# Altium schematic sheet GPIO.SchDoc
size A3; SheetNumber: 9; SheetTotal: 15
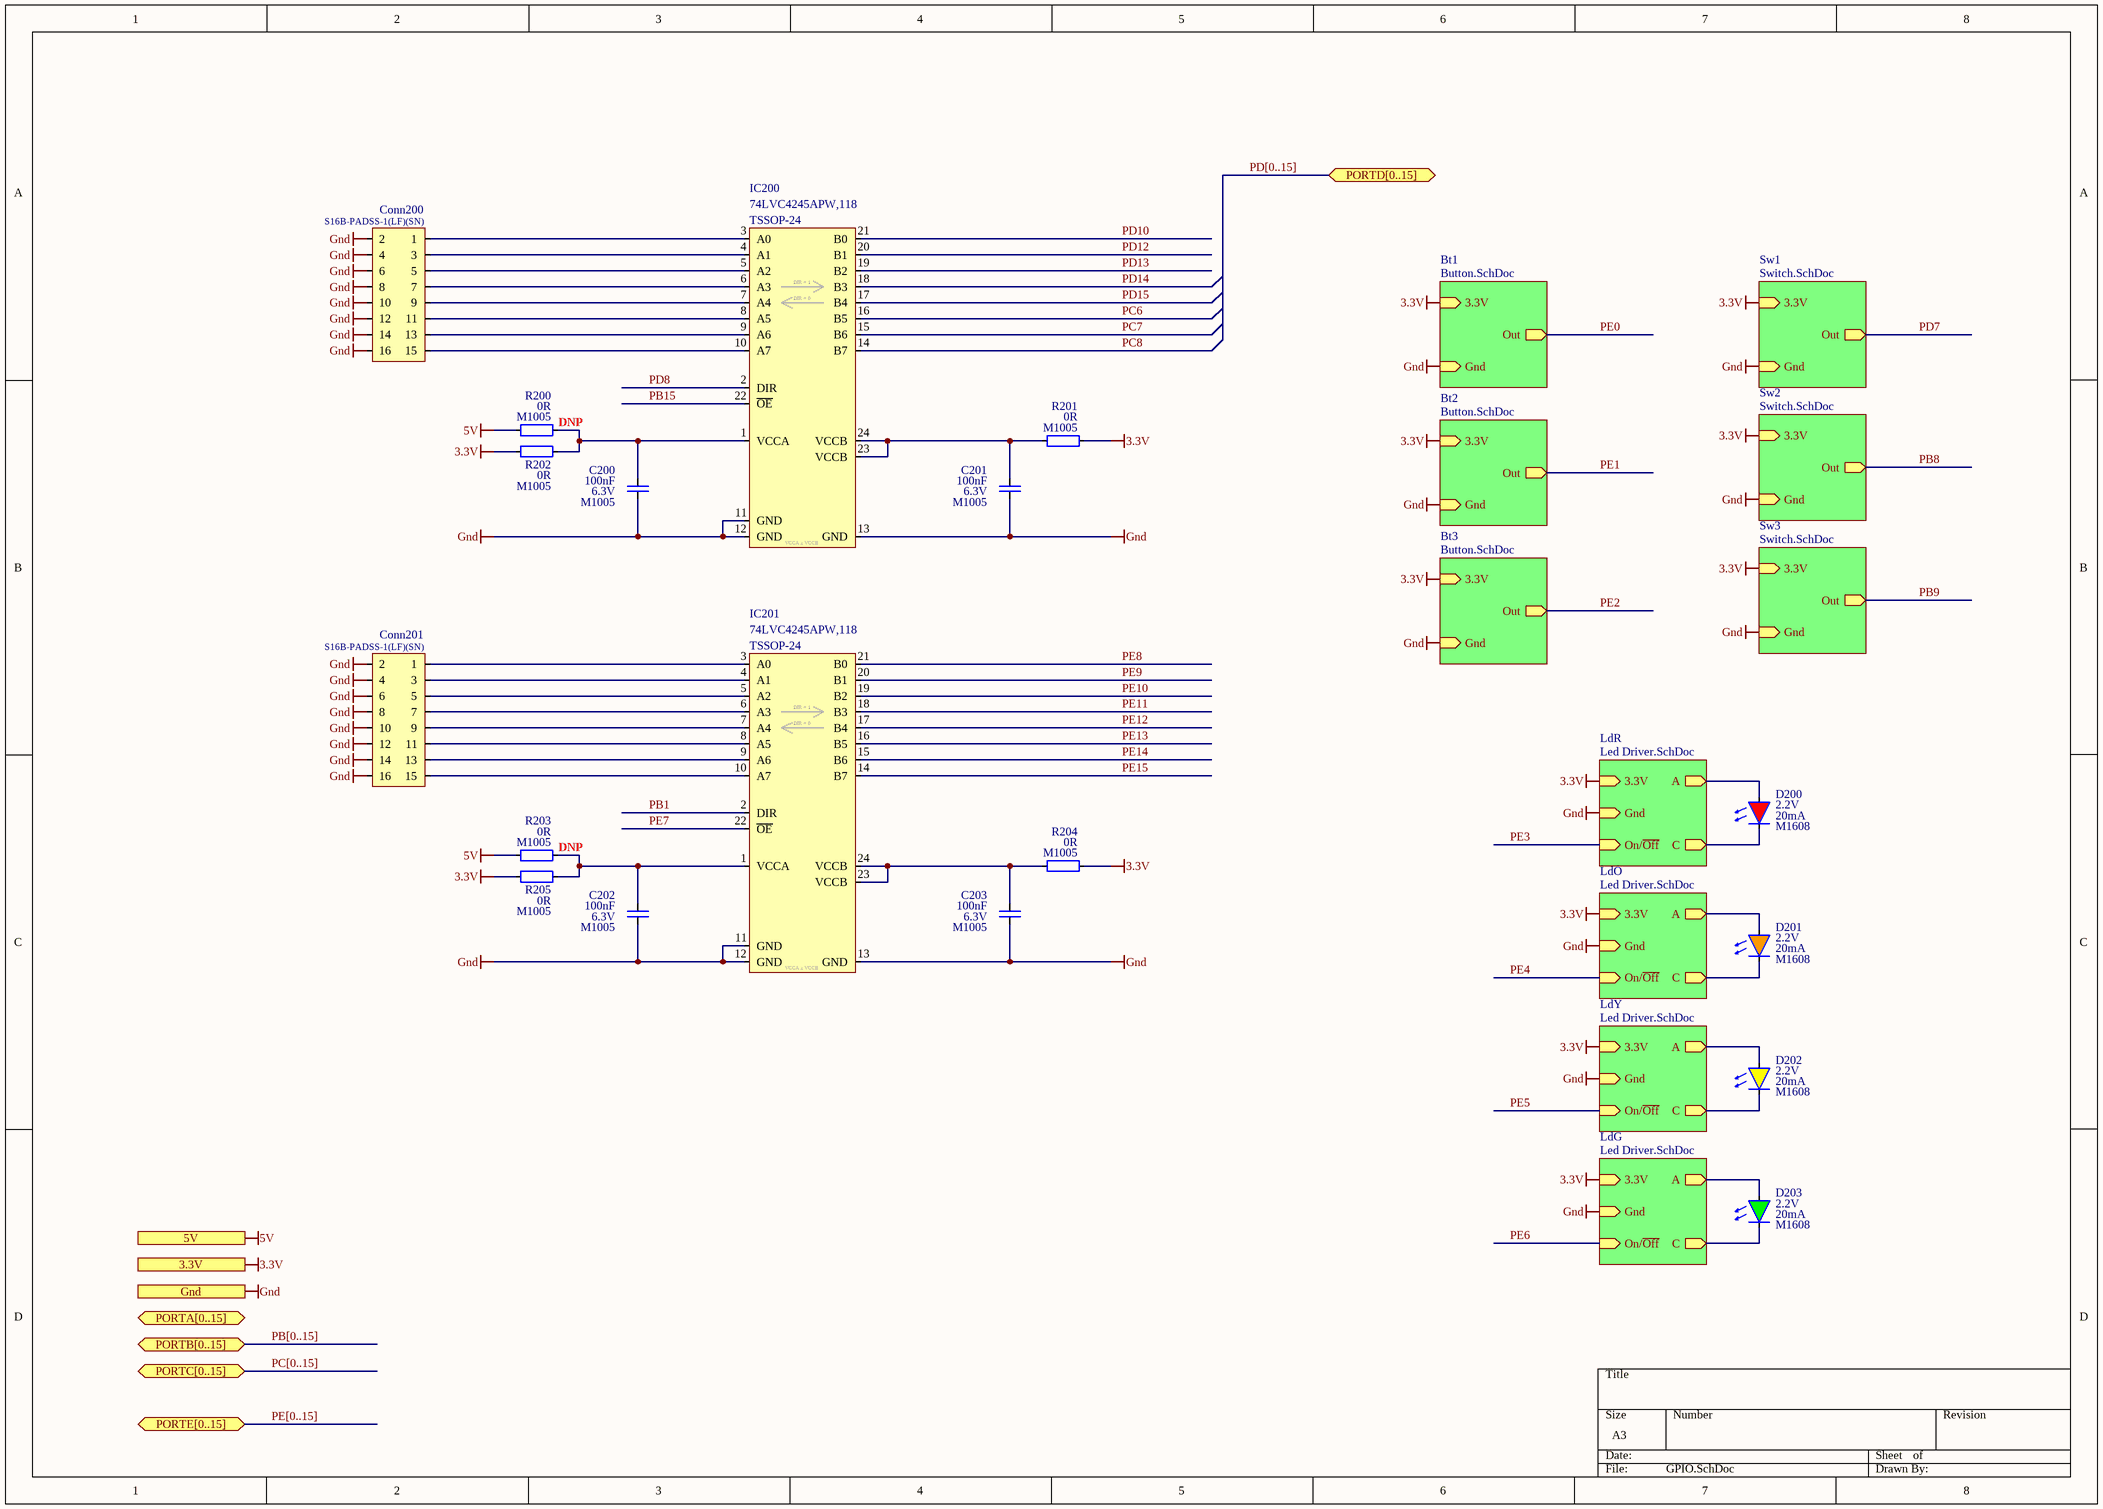
[diagram p0: GPIO.SchDoc]

## Parts
C200  value 100nF  Voltage: 6.3V  Package: M1005  [Capacitor_Ceramic_M1005_I0402]  (hidden comment: Capacitor_Ceramic)
C201  value 100nF  Voltage: 6.3V  Package: M1005  [Capacitor_Ceramic_M1005_I0402]  (hidden comment: Capacitor_Ceramic)
C202  value 100nF  Voltage: 6.3V  Package: M1005  [Capacitor_Ceramic_M1005_I0402]  (hidden comment: Capacitor_Ceramic)
C203  value 100nF  Voltage: 6.3V  Package: M1005  [Capacitor_Ceramic_M1005_I0402]  (hidden comment: Capacitor_Ceramic)
Conn200  Manufacturer Part Number: S16B-PADSS-1(LF)(SN)  [Connector, S16B-PADSS-1]  (hidden comment: Connector - 16P)
Conn201  Manufacturer Part Number: S16B-PADSS-1(LF)(SN)  [Connector, S16B-PADSS-1]  (hidden comment: Connector - 16P)
D200  Current: 20mA  Voltage: 2.2V  Package: M1608  [Diode_Smd_M1608_I0603_Red]  (hidden comment: Diode_Led)
D201  Current: 20mA  Voltage: 2.2V  Package: M1608  [Diode_Smd_M1608_I0603_Orange1]  (hidden comment: Diode_Led)
D202  Current: 20mA  Voltage: 2.2V  Package: M1608  [Diode_Smd_M1608_I0603_Yellow]  (hidden comment: Diode_Led)
D203  Current: 20mA  Voltage: 2.2V  Package: M1608  [Diode_Smd_M1608_I0603_Green-Yellow]  (hidden comment: Diode_Led)
IC200  Manufacturer Part Number: 74LVC4245APW,118  [TSSOP-24]  (hidden comment: Nexperia, 74LVC4245A)
IC201  Manufacturer Part Number: 74LVC4245APW,118  [TSSOP-24]  (hidden comment: Nexperia, 74LVC4245A)
R200  value 0R  Package: M1005  [Resistor_Smd_M1005_I0402]  (hidden comment: Resistor)
R201  value 0R  Package: M1005  [Resistor_Smd_M1005_I0402]  (hidden comment: Resistor)
R202  value 0R  Package: M1005  [Resistor_Smd_M1005_I0402]  (hidden comment: Resistor)
R203  value 0R  Package: M1005  [Resistor_Smd_M1005_I0402]  (hidden comment: Resistor)
R204  value 0R  Package: M1005  [Resistor_Smd_M1005_I0402]  (hidden comment: Resistor)
R205  value 0R  Package: M1005  [Resistor_Smd_M1005_I0402]  (hidden comment: Resistor)

## Sub-sheets
Bt1 = Button.SchDoc: 3.3V (in), Gnd (in), Out (out)
Bt2 = Button.SchDoc: 3.3V (in), Gnd (in), Out (out)
Bt3 = Button.SchDoc: 3.3V (in), Gnd (in), Out (out)
LdG = Led Driver.SchDoc: 3.3V (in), Gnd (in), A (out), C (out), On/~{Off} (in)
LdO = Led Driver.SchDoc: 3.3V (in), Gnd (in), A (out), C (out), On/~{Off} (in)
LdR = Led Driver.SchDoc: 3.3V (in), Gnd (in), A (out), C (out), On/~{Off} (in)
LdY = Led Driver.SchDoc: 3.3V (in), Gnd (in), A (out), C (out), On/~{Off} (in)
Sw1 = Switch.SchDoc: 3.3V (in), Gnd (in), Out (out)
Sw2 = Switch.SchDoc: 3.3V (in), Gnd (in), Out (out)
Sw3 = Switch.SchDoc: 3.3V (in), Gnd (in), Out (out)

## Ports
3.3V (in), 5V (in), Gnd (in), PORTA[0..15] (bidir), PORTB[0..15] (bidir), PORTC[0..15] (bidir), PORTD[0..15] (bidir), PORTE[0..15] (bidir)

## Nets
3.3V: R201.1 R202.2 R204.1 R205.2 ; port 3.3V, sheet Bt1/3.3V, sheet Bt2/3.3V, sheet Bt3/3.3V, sheet Sw1/3.3V, sheet Sw2/3.3V, sheet Sw3/3.3V, sheet LdR/3.3V, sheet LdO/3.3V, sheet LdY/3.3V, sheet LdG/3.3V
5V: R200.2 R203.2 ; port 5V
Gnd: C200.2 C201.2 C202.2 C203.2 Conn200.2 Conn200.4 Conn200.6 Conn200.8 Conn200.10 Conn200.12 Conn200.14 Conn200.16 Conn201.2 Conn201.4 Conn201.6 Conn201.8 Conn201.10 Conn201.12 Conn201.14 Conn201.16 IC200.11(GND) IC200.12(GND) IC200.13(GND) IC201.11(GND) IC201.12(GND) IC201.13(GND) ; port Gnd, sheet Bt1/Gnd, sheet Bt2/Gnd, sheet Bt3/Gnd, sheet Sw1/Gnd, sheet Sw2/Gnd, sheet Sw3/Gnd, sheet LdR/Gnd, sheet LdO/Gnd, sheet LdY/Gnd, sheet LdG/Gnd
PB1: IC201.2(DIR)
PB8: sheet Sw2/Out
PB9: sheet Sw3/Out
PB15: IC200.22(~{OE})
PC6: IC200.16(B5)
PC7: IC200.15(B6)
PC8: IC200.14(B7)
PD7: sheet Sw1/Out
PD8: IC200.2(DIR)
PD10: IC200.21(B0)
PD12: IC200.20(B1)
PD13: IC200.19(B2)
PD14: IC200.18(B3)
PD15: IC200.17(B4)
PE0: sheet Bt1/Out
PE1: sheet Bt2/Out
PE2: sheet Bt3/Out
PE3: sheet LdR/On/~{Off}
PE4: sheet LdO/On/~{Off}
PE5: sheet LdY/On/~{Off}
PE6: sheet LdG/On/~{Off}
PE7: IC201.22(~{OE})
PE8: IC201.21(B0)
PE9: IC201.20(B1)
PE10: IC201.19(B2)
PE11: IC201.18(B3)
PE12: IC201.17(B4)
PE13: IC201.16(B5)
PE14: IC201.15(B6)
PE15: IC201.14(B7)
NetC200_1: C200.1 IC200.1(VCCA) R200.1 R202.1
NetC201_1: C201.1 IC200.23(VCCB) IC200.24(VCCB) R201.2
NetC202_1: C202.1 IC201.1(VCCA) R203.1 R205.1
NetC203_1: C203.1 IC201.23(VCCB) IC201.24(VCCB) R204.2
NetConn200_1: Conn200.1 IC200.3(A0)
NetConn200_3: Conn200.3 IC200.4(A1)
NetConn200_5: Conn200.5 IC200.5(A2)
NetConn200_7: Conn200.7 IC200.6(A3)
NetConn200_9: Conn200.9 IC200.7(A4)
NetConn200_11: Conn200.11 IC200.8(A5)
NetConn200_13: Conn200.13 IC200.9(A6)
NetConn200_15: Conn200.15 IC200.10(A7)
NetConn201_1: Conn201.1 IC201.3(A0)
NetConn201_3: Conn201.3 IC201.4(A1)
NetConn201_5: Conn201.5 IC201.5(A2)
NetConn201_7: Conn201.7 IC201.6(A3)
NetConn201_9: Conn201.9 IC201.7(A4)
NetConn201_11: Conn201.11 IC201.8(A5)
NetConn201_13: Conn201.13 IC201.9(A6)
NetConn201_15: Conn201.15 IC201.10(A7)
NetD200_A: D200.A ; sheet LdR/A
NetD200_C: D200.C ; sheet LdR/C
NetD201_A: D201.A ; sheet LdO/A
NetD201_C: D201.C ; sheet LdO/C
NetD202_A: D202.A ; sheet LdY/A
NetD202_C: D202.C ; sheet LdY/C
NetD203_A: D203.A ; sheet LdG/A
NetD203_C: D203.C ; sheet LdG/C

## Buses and harness runs
bus PB[0..15] = port PORTB[0..15]
bus PC[0..15] = port PORTC[0..15]
bus PD[0..15] = port PORTD[0..15]
bus PE[0..15] = port PORTE[0..15]

## Notes on the sheet
- (near R200) DNP
- (near R203) DNP
- (in symbol Nexperia, 74LVC4245A) DIR = 1; DIR = 0; VCCA ≥ VCCB

## Library data of the parts
C200-C203 = Capacitor_Ceramic: Cap, Cer, 100nF, 6.3V, M1005; Manufacturer Part Number: 04026D104KAT4A; Manufacturer: Kyocera; Temperature Coefficient: X5R; Tolerance: 10%; ComponentLink1Description: Datasheet; ComponentLink1URL: E:\Altium\Datasheets\Capacitor\Kyocera - X5R.pdf; ComponentLink2Description: Supplier Link; ComponentLink2URL: https://www.digikey.com/en/products/detail/kyocera-avx/04026D104KAT4A/8107673; Supplier: Digikey; Supplier Part Number: 478-11504-1-ND; Operating Temperature, Min: +85℃; Operating Temperature, Max: -55℃; Quantity, Min: 1; Quantity, Max: 250000; Price, Min: 0.1; Supplier Currency: $; Price, Max: 0.00189; Supplier Link: https://www.digikey.com/en/products/detail/kyocera-avx/04026D104KAT4A/8107673; Component Type: Ceramic; Component Category: Capacitor
Conn200 Conn201 = Connector - 16P: Conn, JST, 16P, TH, PAD, Side Entry; ComponentLink1Description: Datasheet; ComponentLink1URL: E:\Altium\Datasheets\Connector - JST\PAD Family.pdf; ComponentLink2Description: Supplier Link; ComponentLink2URL: https://www.digikey.com/en/products/detail/jst-sales-america-inc/S16B-PADSS-1-LF-SN/1634778; Supplier: Digikey; Supplier Part Number: 455-2037-ND; Manufacturer: JST; Operating Temperature, Min: -25℃; Operating Temperature, Max: +85℃; Quantity, Min: 1; Quantity, Max: 10080; Price, Min: 0.77; Supplier Currency: $; Price, Max: 0.35386; Supplier Link: https://www.digikey.com/en/products/detail/jst-sales-america-inc/S16B-PADSS-1-LF-SN/1634778; Component Type: PCB; Component Category: Connector; Package: TH, 2 Rows, RA, Side Entry
D200 = Diode_Led: Diode, Led, Red, 2.2V, 20mA, M1608; Manufacturer Part Number: SML-D12U1WT86; Manufacturer: Rohm; ComponentLink1Description: Datasheet; ComponentLink1URL: E:\Altium\Datasheets\Diode\Rohm, SML-D12x1 Series.pdf; ComponentLink2Description: Supplier Link; ComponentLink2URL: https://www.digikey.com/en/products/detail/rohm-semiconductor/SML-D12U1WT86/5843853; Supplier: Digikey; Supplier Part Number: SML-D12U1WT86CT-ND; Operating Temperature, Min: -40℃; Operating Temperature, Max: +85℃; Quantity, Min: 1; Quantity, Max: 75000; Price, Min: 0.25; Price, Max: 0.02838; Supplier Currency: $; Supplier Link: https://www.digikey.com/en/products/detail/rohm-semiconductor/SML-D12U1WT86/5843853; Component Type: Led; Component Category: Diode
D201 = Diode_Led: Diode, Led, Orange, 2.2V, 20mA, M1608; Manufacturer Part Number: SML-D12D1WT86; Manufacturer: Rohm; ComponentLink1Description: Datasheet; ComponentLink1URL: E:\Altium\Datasheets\Diode\Rohm, SML-D12x1 Series.pdf; ComponentLink2Description: Supplier Link; ComponentLink2URL: https://www.digikey.com/en/products/detail/rohm-semiconductor/SML-D12D1WT86/5843854; Supplier: Digikey; Supplier Part Number: SML-D12D1WT86CT-ND; Operating Temperature, Min: -40℃; Operating Temperature, Max: +85℃; Quantity, Min: 1; Quantity, Max: 75000; Price, Min: 0.25; Price, Max: 0.02838; Supplier Currency: $; Supplier Link: https://www.digikey.com/en/products/detail/rohm-semiconductor/SML-D12D1WT86/5843854; Component Type: Led; Component Category: Diode
D202 = Diode_Led: Diode, Led, Yellow, 2.2V, 20mA, M1608; Manufacturer Part Number: SML-D12Y1WT86; Manufacturer: Rohm; ComponentLink1Description: Datasheet; ComponentLink1URL: E:\Altium\Datasheets\Diode\Rohm, SML-D12x1 Series.pdf; ComponentLink2Description: Supplier Link; ComponentLink2URL: https://www.digikey.com/en/products/detail/rohm-semiconductor/SML-D12Y1WT86/5843855; Supplier: Digikey; Supplier Part Number: SML-D12Y1WT86CT-ND; Operating Temperature, Min: -40℃; Operating Temperature, Max: +85℃; Quantity, Min: 1; Quantity, Max: 75000; Price, Min: 0.25; Price, Max: 0.02838; Supplier Currency: $; Supplier Link: https://www.digikey.com/en/products/detail/rohm-semiconductor/SML-D12Y1WT86/5843855; Component Type: Led; Component Category: Diode
D203 = Diode_Led: Diode, Led, Green-Yellow, 2.2V, 20mA, M1608; Manufacturer Part Number: SML-D12M1WT86; Manufacturer: Rohm; ComponentLink1Description: Datasheet; ComponentLink1URL: E:\Altium\Datasheets\Diode\Rohm, SML-D12x1 Series.pdf; ComponentLink2Description: Supplier Link; ComponentLink2URL: https://www.digikey.com/en/products/detail/rohm-semiconductor/SML-D12M1WT86/5843856; Supplier: Digikey; Supplier Part Number: SML-D12M1WT86CT-ND; Operating Temperature, Min: -40℃; Operating Temperature, Max: +85℃; Quantity, Min: 1; Quantity, Max: 75000; Price, Min: 0.25; Price, Max: 0.02838; Supplier Currency: $; Supplier Link: https://www.digikey.com/en/products/detail/rohm-semiconductor/SML-D12M1WT86/5843856; Component Type: Led; Component Category: Diode
IC200 IC201 = Nexperia, 74LVC4245A: IC, Buffer, TSSOP-24; ComponentLink1Description: Datasheet; ComponentLink1URL: E:\Altium\Datasheets\IC - Buffer\Nexperia, 74LVC4245A.pdf; ComponentLink2Description: Supplier Link; ComponentLink2URL: https://www.digikey.com/en/products/detail/nexperia-usa-inc/74LVC4245APW-118/1231659; Supplier: Digikey; Supplier Part Number: 1727-4308-1-ND; Manufacturer: Nexperia; Operating Temperature, Min: -40℃; Operating Temperature, Max: +125℃; Quantity, Min: 1; Quantity, Max: 5000; Price, Min: 0.34185; Supplier Currency: $; Price, Max: 0.91; Supplier Link: https://www.digikey.com/en/products/detail/nexperia-usa-inc/74LVC4245APW-118/1231659; Component Type: Buffer; Component Category: IC; Package: TSSOP-24
R200-R205 = Resistor: Res, 0R, M1005; Manufacturer: Yageo; Manufacturer Part Number: RC0402FR-070RL; Component Category: Resistor; Component Type: Fixed Value; Tolerance: *; Supplier Link: https://www.digikey.com/en/products/detail/yageo/RC0402FR-070RL/2827570; Supplier Currency: $; Price, Max: 0.00109; Price, Min: 0.1; Quantity, Max: 50000; Quantity, Min: 1; Operating Temperature, Max: -55℃; Operating Temperature, Min: +155℃; Supplier Part Number: 311-0.0LRCT-ND; Supplier: Digikey; ComponentLink1Description: Datasheet; ComponentLink1URL: E:\Altium\Datasheets\Resistor\Yageo - RC_L Series.pdf; ComponentLink2Description: Supplier Link; ComponentLink2URL: https://www.digikey.com/en/products/detail/yageo/RC0402FR-070RL/2827570